# Altium schematic sheet J-Link ARM-OB.SchDoc
size A4
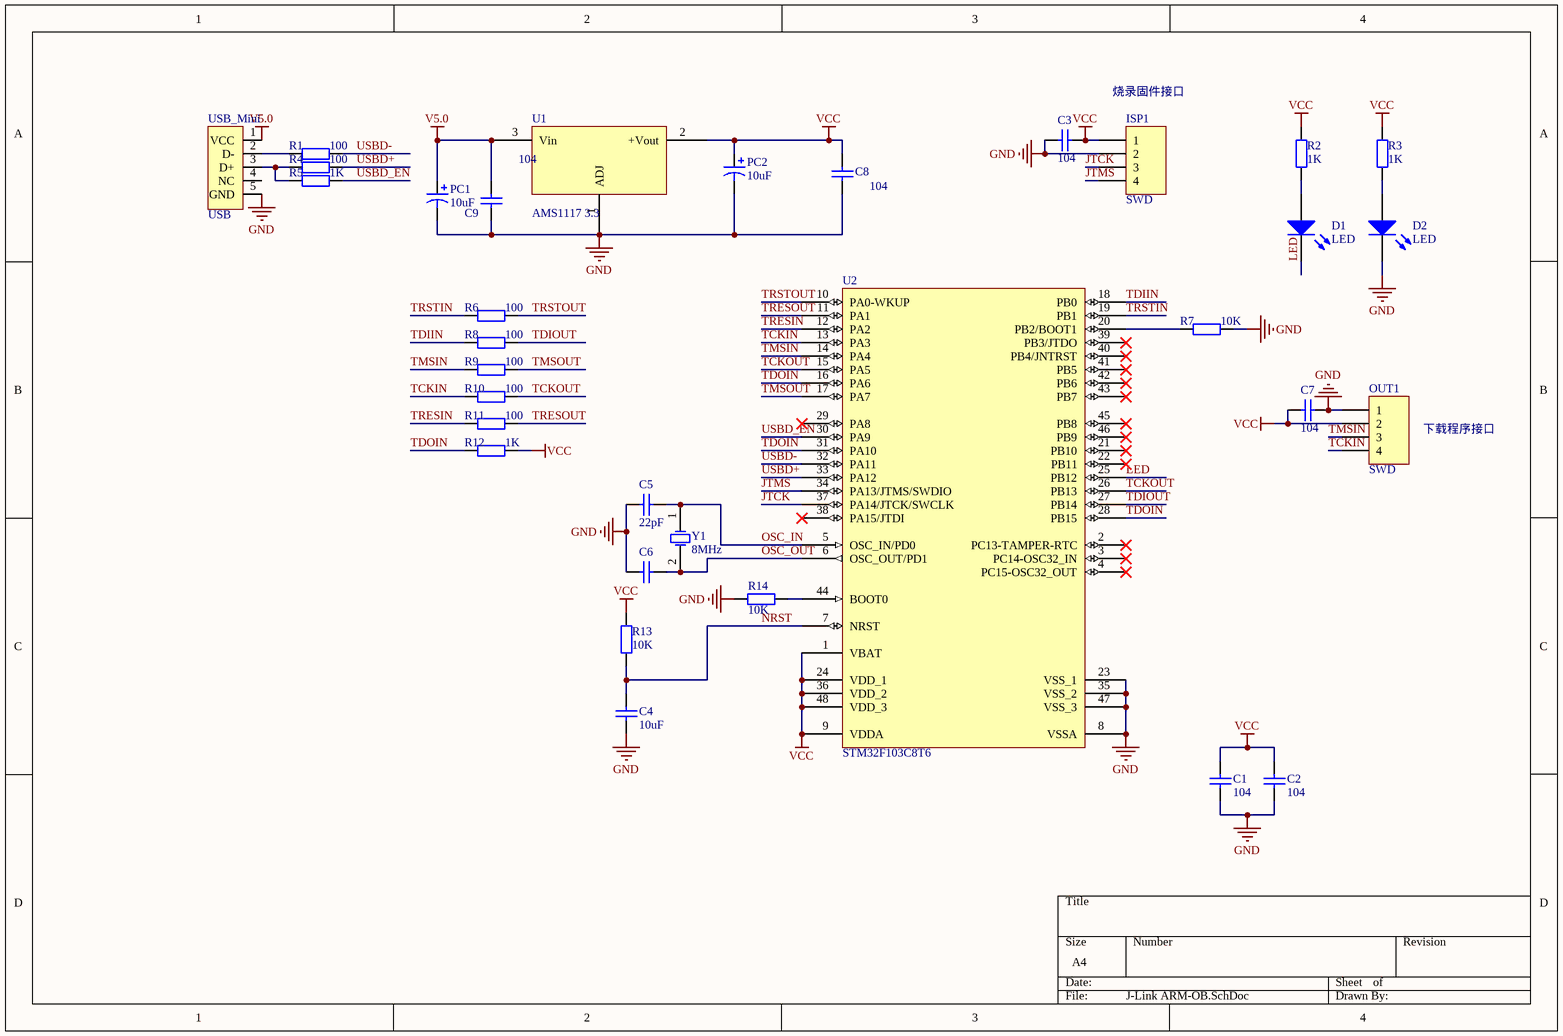
[diagram p0: J-Link ARM-OB.SchDoc]

## Parts
C1  value 104  [C0603]
C2  value 104  [C0603]
C3  value 104  [C0603]
C4  value 10uF  [C0603]
C5  value 22pF  [C0603]
C6  (no value)  [C0603]
C7  value 104  [C0603]
C8  value 104  [C0603]
C9  value 104  [C0603]
D1  LED  [LED-DIP2]
D2  LED  [LED-DIP2]
ISP1  SWD  [HDR1X4]
OUT1  SWD  [HDR1X4]
PC1  value 10uF  [C1206A]
PC2  value 10uF  [C1206A]
R1  value 100  [R0603]
R2  value 1K  [R0603]
R3  value 1K  [R0603]
R4  value 100  [R0603]
R5  value 1K  [R0603]
R6  value 100  [R0603]
R7  value 10K  [R0603]
R8  value 100  [R0603]
R9  value 100  [R0603]
R10  value 100  [R0603]
R11  value 100  [R0603]
R12  value 1K  [R0603]
R13  value 10K  [R0603]
R14  value 10K  [R0603]
U1  AMS1117 3.3  [SOT-223]
U2  STM32F103C8T6  [LQFP48_N]
USB_Mini  USB  [USB Mini]
Y1  8MHz  [JZ]

## Nets
GND: C1.2 C2.2 C3.1 C4.2 C5.2 C6.2 C7.2 C8.2 C9.2 D2.2(K) ISP1.2 OUT1.1 PC1.2 PC2.2 R7.2 R14.1 U1.1(ADJ) U2.8(VSSA) U2.23(VSS_1) U2.35(VSS_2) U2.47(VSS_3) USB_Mini.5(GND)
V5.0: C9.1 PC1.1 U1.3(Vin) USB_Mini.1(VCC)
VCC: C1.1 C2.1 C3.2 C7.1 C8.1 ISP1.1 OUT1.2 PC2.1 R2.2 R3.2 R12.2 R13.2 U1.2(+Vout) U2.1(VBAT) U2.9(VDDA) U2.24(VDD_1) U2.36(VDD_2) U2.48(VDD_3)
JTCK: ISP1.3 U2.37(PA14/JTCK/SWCLK)
JTMS: ISP1.4 U2.34(PA13/JTMS/SWDIO)
LED: D1.2(K) U2.25(PB12)
NRST: C4.1 R13.1 U2.7(NRST)
OSC_IN: C5.1 U2.5(OSC_IN/PD0) Y1.1(OSC1)
OSC_OUT: C6.1 U2.6(OSC_OUT/PD1) Y1.2(OSC2)
TCKIN: OUT1.4 R10.1 U2.13(PA3)
TCKOUT: R10.2 U2.15(PA5) U2.26(PB13)
TDIIN: R8.1 U2.18(PB0)
TDIOUT: R8.2 U2.27(PB14)
TDOIN: R12.1 U2.16(PA6) U2.28(PB15) U2.31(PA10)
TMSIN: OUT1.3 R9.1 U2.14(PA4)
TMSOUT: R9.2 U2.17(PA7)
TRESIN: R11.1 U2.12(PA2)
TRESOUT: R11.2 U2.11(PA1)
TRSTIN: R6.1 U2.19(PB1)
TRSTOUT: R6.2 U2.10(PA0-WKUP)
USBD+: R4.2 U2.33(PA12)
USBD-: R1.2 U2.32(PA11)
USBD_EN: R5.2 U2.30(PA9)
NetD1_1: D1.1(A) R2.1
NetD2_1: D2.1(A) R3.1
NetR1_1: R1.1 USB_Mini.2(D-)
NetR4_1: R4.1 R5.1 USB_Mini.3(D+)
NetR7_1: R7.1 U2.20(PB2/BOOT1)
NetR14_2: R14.2 U2.44(BOOT0)

Not connected (* = marked no-connect by the designer): U2 2(PC13-TAMPER-RTC)* 3(PC14-OSC32_IN)* 4(PC15-OSC32_OUT)* 21(PB10)* 22(PB11)* 29(PA8)* 38(PA15/JTDI)* 39(PB3/JTDO)* 40(PB4/JNTRST)* 41(PB5)* 42(PB6)* 43(PB7)* 45(PB8)* 46(PB9)*; USB_Mini 4(NC)

## Notes on the sheet
- 烧录固件接口
- 下载程序接口

## Library data of the parts
C1-C9 = Cap: Capacitor; Published: 8-Jun-2000; LatestRevisionDate: 17-Jul-2002; LatestRevisionNote: Re-released for DXP Platform.; PackageReference: RAD-0.3; Publisher: Altium Limited
D1 D2 = LED: Typical RED, GREEN, YELLOW, AMBER GaAs LED; Published: 8-Jun-2000; LatestRevisionDate: 17-Jul-2002; LatestRevisionNote: Re-released for DXP Platform.; PackageVersion: Feb-2002; PackageReference: 3.2X1.6X1.1; Publisher: Altium Limited
ISP1 OUT1 = Header 4: Header, 4-Pin; LatestRevisionDate: 17-Jul-2002; LatestRevisionNote: Re-released for DXP Platform.; Publisher: Altium Limited
PC1 PC2 = Cap Pol3: Polarized Capacitor (Surface Mount); Published: 8-Jun-2000; LatestRevisionDate: 29-May-2009; LatestRevisionNote: IPC-7351 Footprint Added.; PackageReference: C0805; Publisher: Altium Limited; PackageDescription: Chip Capacitor
R1-R14 = Res2: Resistor; Published: 8-Jun-2000; LatestRevisionDate: 17-Jul-2002; LatestRevisionNote: Re-released for DXP Platform.; PackageReference: AXIAL-0.4; Publisher: Altium Limited
U1 = LM117T
U2 = STM32F103C8T6: STM32 ARM-based 32-bit MCU with 64 Kbytes Flash, 48-pin LQFP, Industrial Temperature; Published: 30-May-2008; DatasheetVersion: rev6, Mar-2008; PackageVersion: Mar-2008; PackageReference: LQFP48; Publisher: Altium Limited; PackageDescription: 48-Pin Low-Profile Quad Flat Pack, 7 x 7 mm Body, 0.5 mm Pitch (LQFP48); ComponentLink1Description: Manufacturer Link; ComponentLink1URL: www.st.com/stm32; ComponentLink2Description: Datasheet; ComponentLink2URL: http://www.st.com/stonline/products/literature/ds/13587.pdf
USB_Mini = USB5
Y1 = XTAL: Crystal Oscillator; Published: 8-Jun-2000; LatestRevisionDate: 17-Jul-2002; LatestRevisionNote: Re-released for DXP Platform.; PackageReference: R38; Publisher: Altium Limited